# Altium project ProjetManetteCapteurs.PrjPcb
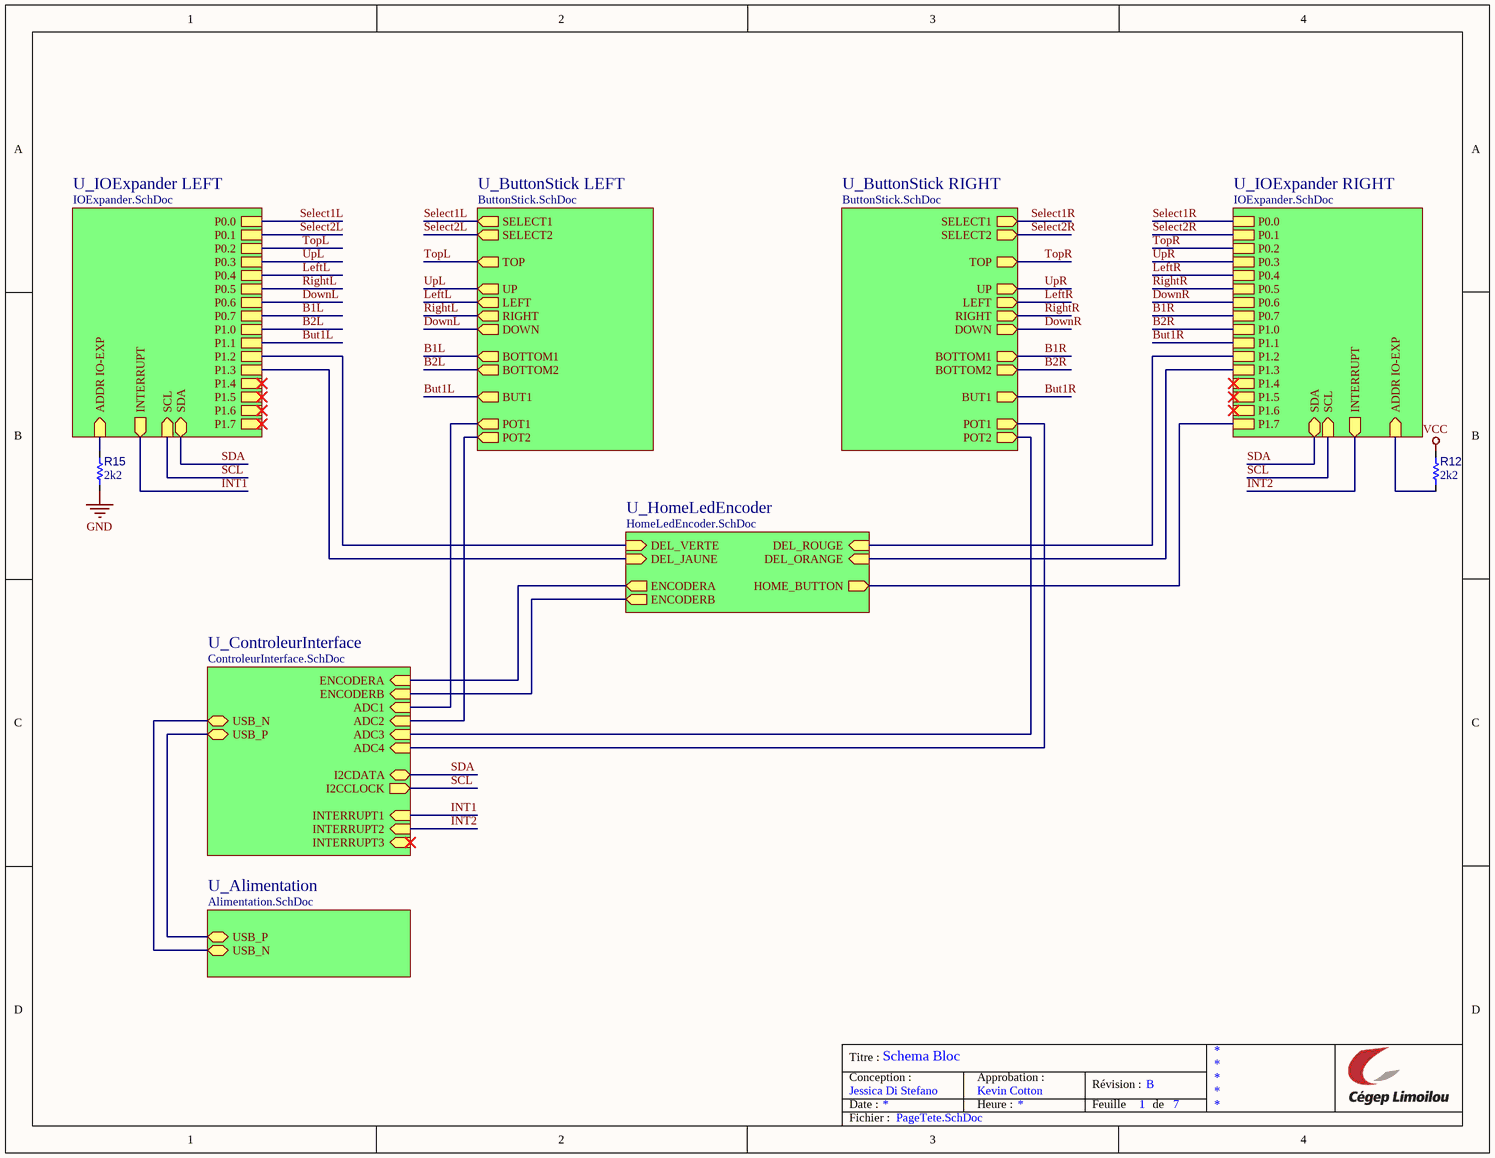
[diagram p0: PageTete.SchDoc]
7 sheets, 73 parts. Net scope: hierarchical (ports join the sheet entries above them; power ports are global).
Board file: CapteurPCB.PcbDoc
Sheets:
  PageTete.SchDoc
    U_Alimentation = Alimentation.SchDoc
    U_ButtonStick LEFT = ButtonStick.SchDoc
    U_ControleurInterface = ControleurInterface.SchDoc
    U_HomeLedEncoder = HomeLedEncoder.SchDoc
    U_IOExpander LEFT = IOExpander.SchDoc
    U_ButtonStick RIGHT = ButtonStick.SchDoc
    U_IOExpander RIGHT = IOExpander.SchDoc
  SchemaBloc.SchDoc

## Sheet PageTete.SchDoc: Schema Bloc
size Letter; ApprovedBy: Kevin Cotton; Author: Jessica Di Stefano; Revision: B; SheetNumber: 1; SheetTotal: 7

### Parts
R12  value 2k2  [R_1005[0402]]  (hidden comment: Res 2k2 1% 0402)
R15  value 2k2  [R_1005[0402]]  (hidden comment: Res 2k2 1% 0402)

### Sub-sheets
U_Alimentation = Alimentation.SchDoc: USB_P (bidir), USB_N (bidir)
U_ButtonStick LEFT = ButtonStick.SchDoc: BOTTOM1 (out), UP (out), LEFT (out), SELECT1 (out), TOP (out), BOTTOM2 (out), RIGHT (out), DOWN (out), SELECT2 (out), POT2 (out), POT1 (out), BUT1 (out)
U_ButtonStick RIGHT = ButtonStick.SchDoc: BOTTOM1 (out), UP (out), LEFT (out), SELECT1 (out), TOP (out), BOTTOM2 (out), RIGHT (out), DOWN (out), SELECT2 (out), POT2 (out), POT1 (out), BUT1 (out)
U_ControleurInterface = ControleurInterface.SchDoc: USB_N (bidir), USB_P (bidir), ADC1 (in), ADC2 (in), ADC3 (in), ADC4 (in), INTERRUPT1 (in), INTERRUPT2 (in), INTERRUPT3 (in), ENCODERB (in), ENCODERA (in), I2CDATA (bidir), I2CCLOCK (out)
U_HomeLedEncoder = HomeLedEncoder.SchDoc: DEL_VERTE (in), DEL_ORANGE (in), DEL_JAUNE (in), DEL_ROUGE (in), ENCODERA (out), ENCODERB (out), HOME_BUTTON (out)
U_IOExpander LEFT = IOExpander.SchDoc: P0.0, P0.1, P0.2, P0.3, P0.4, P0.5, P0.6, P0.7, P1.0, P1.1, P1.2, P1.3, P1.4, P1.5, P1.6, P1.7, ADDR IO-EXP (in), SCL (in), SDA (bidir), INTERRUPT (out)
U_IOExpander RIGHT = IOExpander.SchDoc: P0.0, P0.1, P0.2, P0.3, P0.4, P0.5, P0.6, P0.7, P1.0, P1.1, P1.2, P1.3, P1.4, P1.5, P1.6, P1.7, ADDR IO-EXP (in), SCL (in), SDA (bidir), INTERRUPT (out)

### Nets
GND: R15.1
VCC: R12.2
ADC1: sheet U_ButtonStick LEFT/POT1, sheet U_ControleurInterface/ADC1
ADC2: sheet U_ButtonStick LEFT/POT2, sheet U_ControleurInterface/ADC2
ADC3: sheet U_ControleurInterface/ADC3, sheet U_ButtonStick RIGHT/POT2
ADC4: sheet U_ControleurInterface/ADC4, sheet U_ButtonStick RIGHT/POT1
B1L: sheet U_ButtonStick LEFT/BOTTOM1, sheet U_IOExpander LEFT/P0.7
B1R: sheet U_ButtonStick RIGHT/BOTTOM1, sheet U_IOExpander RIGHT/P0.7
B2L: sheet U_ButtonStick LEFT/BOTTOM2, sheet U_IOExpander LEFT/P1.0
B2R: sheet U_ButtonStick RIGHT/BOTTOM2, sheet U_IOExpander RIGHT/P1.0
But1L: sheet U_ButtonStick LEFT/BUT1, sheet U_IOExpander LEFT/P1.1
But1R: sheet U_ButtonStick RIGHT/BUT1, sheet U_IOExpander RIGHT/P1.1
DownL: sheet U_ButtonStick LEFT/DOWN, sheet U_IOExpander LEFT/P0.6
DownR: sheet U_ButtonStick RIGHT/DOWN, sheet U_IOExpander RIGHT/P0.6
ENCODERA: sheet U_ControleurInterface/ENCODERA, sheet U_HomeLedEncoder/ENCODERA
ENCODERB: sheet U_ControleurInterface/ENCODERB, sheet U_HomeLedEncoder/ENCODERB
INT1: sheet U_ControleurInterface/INTERRUPT1, sheet U_IOExpander LEFT/INTERRUPT
INT2: sheet U_ControleurInterface/INTERRUPT2, sheet U_IOExpander RIGHT/INTERRUPT
LeftL: sheet U_ButtonStick LEFT/LEFT, sheet U_IOExpander LEFT/P0.4
LeftR: sheet U_ButtonStick RIGHT/LEFT, sheet U_IOExpander RIGHT/P0.4
RightL: sheet U_ButtonStick LEFT/RIGHT, sheet U_IOExpander LEFT/P0.5
RightR: sheet U_ButtonStick RIGHT/RIGHT, sheet U_IOExpander RIGHT/P0.5
SCL: sheet U_ControleurInterface/I2CCLOCK, sheet U_IOExpander LEFT/SCL, sheet U_IOExpander RIGHT/SCL  [project net I2CCLOCK]
SDA: sheet U_ControleurInterface/I2CDATA, sheet U_IOExpander LEFT/SDA, sheet U_IOExpander RIGHT/SDA  [project net I2CDATA]
Select1L: sheet U_ButtonStick LEFT/SELECT1, sheet U_IOExpander LEFT/P0.0
Select1R: sheet U_ButtonStick RIGHT/SELECT1, sheet U_IOExpander RIGHT/P0.0
Select2L: sheet U_ButtonStick LEFT/SELECT2, sheet U_IOExpander LEFT/P0.1
Select2R: sheet U_ButtonStick RIGHT/SELECT2, sheet U_IOExpander RIGHT/P0.1
TopL: sheet U_ButtonStick LEFT/TOP, sheet U_IOExpander LEFT/P0.2
TopR: sheet U_ButtonStick RIGHT/TOP, sheet U_IOExpander RIGHT/P0.2
UpL: sheet U_ButtonStick LEFT/UP, sheet U_IOExpander LEFT/P0.3
UpR: sheet U_ButtonStick RIGHT/UP, sheet U_IOExpander RIGHT/P0.3
USB_N: sheet U_Alimentation/USB_N, sheet U_ControleurInterface/USB_N
USB_P: sheet U_Alimentation/USB_P, sheet U_ControleurInterface/USB_P
NetDS1_2: sheet U_HomeLedEncoder/DEL_VERTE, sheet U_IOExpander LEFT/P1.2
NetDS2_2: sheet U_HomeLedEncoder/DEL_ORANGE, sheet U_IOExpander RIGHT/P1.3
NetDS3_2: sheet U_HomeLedEncoder/DEL_JAUNE, sheet U_IOExpander LEFT/P1.3
NetDS4_2: sheet U_HomeLedEncoder/DEL_ROUGE, sheet U_IOExpander RIGHT/P1.2
NetR12_1: R12.1 ; sheet U_IOExpander RIGHT/ADDR IO-EXP
NetR15_2: R15.2 ; sheet U_IOExpander LEFT/ADDR IO-EXP
NetS10_1: sheet U_HomeLedEncoder/HOME_BUTTON, sheet U_IOExpander RIGHT/P1.7

### Notes on the sheet
- Titre :
- Conception :
- Date :
- Approbation :
- Heure :
- Révision :
- Feuille
- de
- Fichier :

### Library data of the parts
R12 R15 = RES008: Resistor type 1; Manufacturer 1: Yageo; Manufacturer Part Number 1: RC0402FR-072K2L; Puissance: 1/16W; Max Working Voltage: 50V; LibRef: RES008; Tolerance: 1%; Mount: SMT; Supplier 1: LCSC; Supplier Part Number 1: C114762; Supplier 2: Digi-Key; Supplier Part Number 2: 311-2.20KLRCT-ND

## Sheet Alimentation.SchDoc: Circuit d'alimentation
size Letter; ApprovedBy: Kevin Cotton; Author: Jessica Di Stefano; Revision: B; SheetNumber: 6; SheetTotal: 7
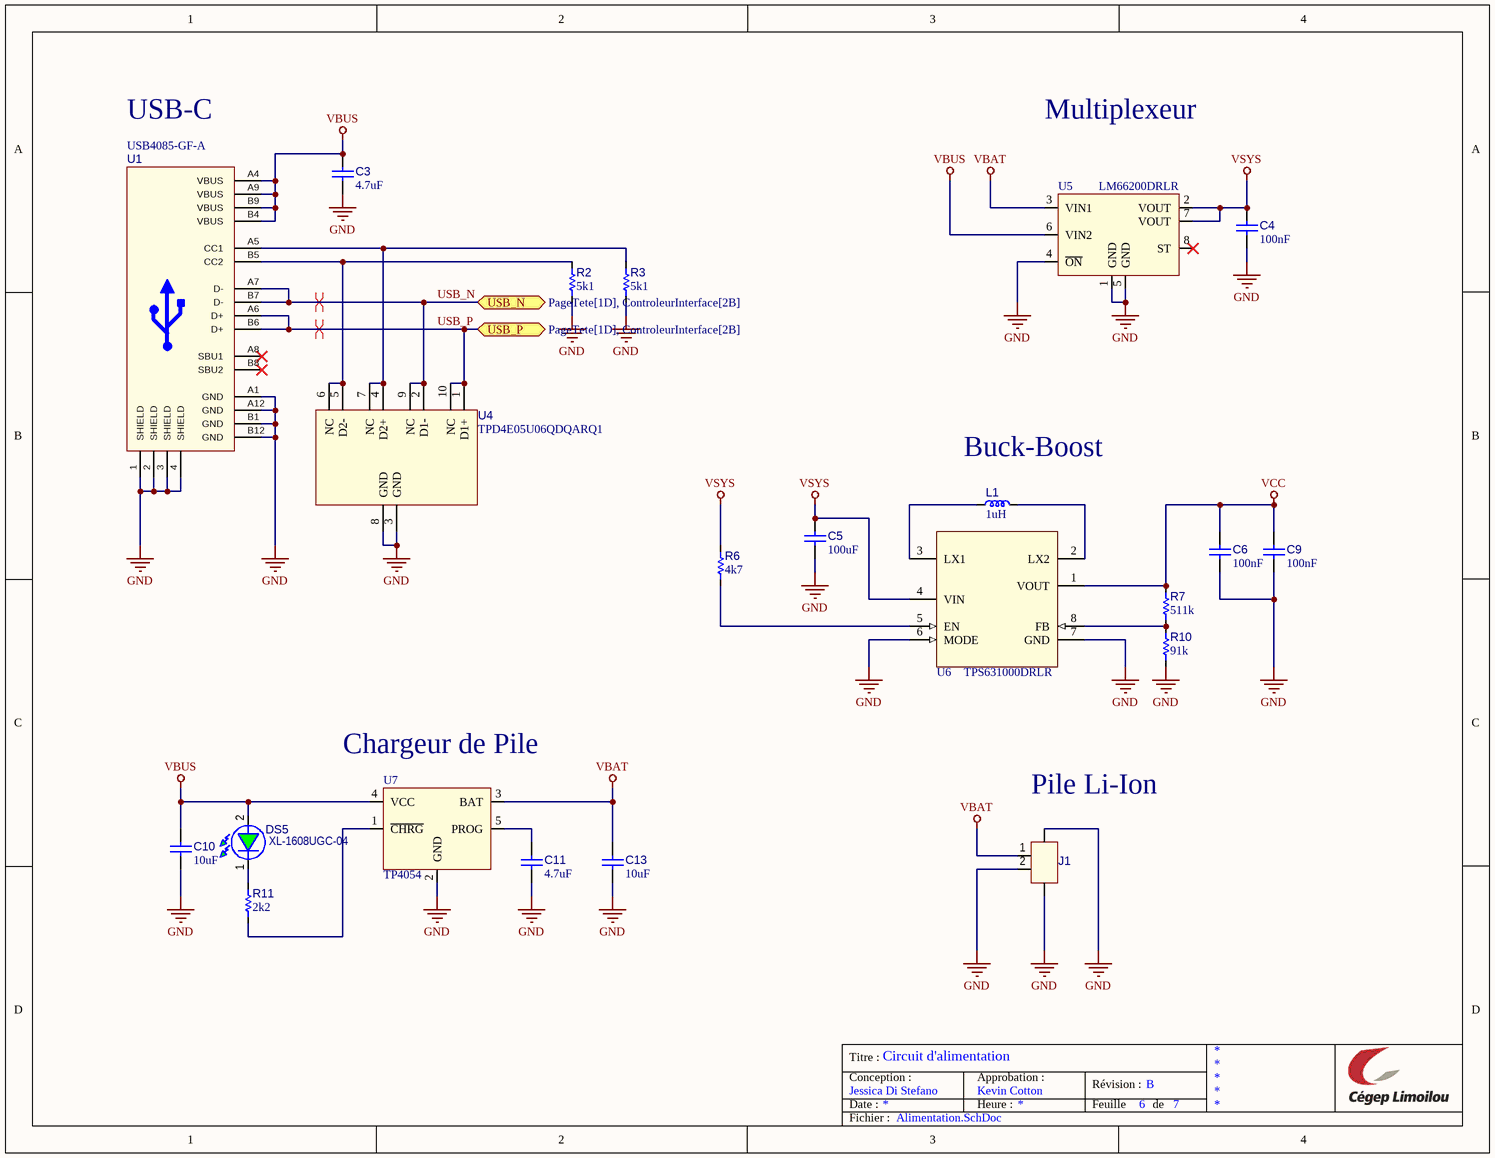
[diagram p1: Alimentation.SchDoc]

### Parts
C3  value 4.7uF  [C_2012[0805]]  (hidden comment: Cap 4.7uF 0805)
C4  value 100nF  [C_1005[0402]]  (hidden comment: Cap 100nF 0402)
C5  value 100uF  [C_3216[1206]]  (hidden comment: Cap 100uF 1206)
C6  value 100nF  [C_1005[0402]]  (hidden comment: Cap 100nF 0402)
C9  value 100nF  [C_1005[0402]]  (hidden comment: Cap 100nF 0402)
C10  value 10uF  [C_2012[0805]]  (hidden comment: Cap 10uF 0805)
C11  value 4.7uF  [C_2012[0805]]  (hidden comment: Cap 4.7uF 0805)
C13  value 10uF  [C_2012[0805]]  (hidden comment: Cap 10uF 0805)
DS5  XL-1608UGC-04  [D_LED_0603]
J1  B2B-PH-SM4-TB  [J_B2B-PH-SM4-TB_JST]  (value not drawn)
L1  value 1uH  [L_3030[1212]]  (hidden comment: Ind 1UH 2.75A 51mOHM SMD)
R2  value 5k1  [R_1005[0402]]  (hidden comment: Res 5k1 1% 0402)
R3  value 5k1  [R_1005[0402]]  (hidden comment: Res 5k1 1% 0402)
R6  value 4k7  [R_1005[0402]]  (hidden comment: Res 4k7 1% 0402)
R7  value 511k  [R_1005[0402]]  (hidden comment: Res 511k 1% 0402)
R10  value 91k  [R_1005[0402]]  (hidden comment: Res 91k 1% 0402)
R11  value 2k2  [R_1005[0402]]  (hidden comment: Res 2k2 1% 0402)
U1  USB4085-GF-A  [FP-USB4085-GF-A-MFG]
U4  TPD4E05U06QDQARQ1  [U_USON50P250X100-10]
U5  LM66200DRLR  [U_SOT583_50P210X120X60-8]
U6  TPS631000DRLR  [U_SOT583_50P210X120X60-8]
U7  TP4054  [U_SOT23-5N(MO-178)]

### Ports
USB_N (bidir, see PageTete[1D], ControleurInterface[2B]), USB_P (bidir, see PageTete[1D], ControleurInterface[2B])

### Nets
GND: C3.1 C4.1 C5.1 C6.2 C9.1 C10.1 C11.1 C13.1 J1.2(Pin_2) J1.S1 J1.S2 R2.1 R3.1 R10.1 U1.1(SHIELD) U1.2(SHIELD) U1.3(SHIELD) U1.4(SHIELD) U1.A1(GND) U1.A12(GND) U1.B1(GND) U1.B12(GND) U4.3(GND) U4.8(GND) U5.1(GND) U5.4(~{ON}) U5.5(GND) U6.6(MODE) U6.7(GND) U7.2(GND)
VBAT: C13.2 J1.1(Pin_1) U5.3(VIN1) U7.3(BAT)
VBUS: C3.2 C10.2 DS5.2(A) U1.A4(VBUS) U1.A9(VBUS) U1.B4(VBUS) U1.B9(VBUS) U5.6(VIN2) U7.4(VCC)
VCC: C6.1 C9.2 R7.2 U6.1(VOUT)
VSYS: C4.2 C5.2 R6.2 U5.2(VOUT) U5.7(VOUT) U6.4(VIN)
USB_N: U1.A7(D-) U1.B7(D-) U4.2(D1-) U4.9(NC) ; port USB_N
USB_P: U1.A6(D+) U1.B6(D+) U4.1(D1+) U4.10(NC) ; port USB_P
NetC11_2: C11.2 U7.5(PROG)
NetDS5_1: DS5.1(K) R11.2
NetL1_1: L1.1 U6.3(LX1)
NetL1_2: L1.2 U6.2(LX2)
NetR2_2: R2.2 U1.B5(CC2) U4.5(D2-) U4.6(NC)
NetR3_2: R3.2 U1.A5(CC1) U4.4(D2+) U4.7(NC)
NetR6_1: R6.1 U6.5(EN)
NetR7_1: R7.1 R10.2 U6.8(FB)
NetR11_1: R11.1 U7.1(~{CHRG})

Not connected (* = marked no-connect by the designer): U1 A8(SBU1)* B8(SBU2)*; U5 8(ST)*

### Layout directives
differential pair: USB_N, USB_P

### Notes on the sheet
- USB-C
- Multiplexeur
- (near L1) Buck-Boost
- (near U7) Chargeur de Pile
- (near J1) Pile Li-Ion
- Titre :
- Conception :
- Date :
- Approbation :
- Heure :
- Révision :
- Feuille
- de
- Fichier :

### Library data of the parts
C3 C11 = CAP003: Capacitor type 1; Manufacturer 1: Taiyo Yuden; Manufacturer Part Number 1: TMK212AB7475KG-T; CEGEP: KCOND02SM; Tolerance: 10%; Rated Voltage: 25V; Dielectric: X7R; LibRef: CAP003; Mount: SMT; Supplier 1: LCSC; Supplier Part Number 1: C163186
C4 C6 C9 = CAP001: Capacitor type 1; Manufacturer 1: Taiyo Yuden; Manufacturer Part Number 1: UMK105B7104KV-FR; CEGEP: KCOND01SM; Tolerance: 10%; Rated Voltage: 50V; Dielectric: X7R; LibRef: CAP001; Mount: SMT; Supplier 1: LCSC; Supplier Part Number 1: C2167491
C5 = CAP005: Capacitor type 1; Manufacturer 1: Murata; Manufacturer Part Number 1: GRM31CR61A107MEA8L; CEGEP: KCOND04SM; Tolerance: 20%; Rated Voltage: 10V; Dielectric: X5R; LibRef: CAP005; Mount: SMT; Supplier 1: LCSC; Supplier Part Number 1: C883598
C10 C13 = CAP004: Capacitor type 1; Manufacturer 1: Samsung; Manufacturer Part Number 1: CL21A106KAYNNNE; CEGEP: KCOND03SM; Tolerance: 10%; Rated Voltage: 25V; Dielectric: X5R; LibRef: CAP004; Mount: SMT; Supplier 1: LCSC; Supplier Part Number 1: C15850
DS5 = D_LED_GREEN_0603: LED Green Clear 40mcd 140deg; Manufacturer 1: XINGLIGHT; CEGEP: KLEDVC0603; Value: Green; Manufacturer 2: Wurth; Manufacturer Part Number 1: XL-1608UGC-04; Manufacturer Part Number 2: 150060VS75000; Mounting Technology: SMT; Supplier 1: LCSC; Supplier 2: Digikey; Supplier Part Number 1: C965804; Supplier Part Number 2: 732-4980-1-ND
J1 = Conn_01x02_B2B-PH-SM4-TB: Conn. 2 pins JST B2B SMT Straight 2mm; Value: Conn_01x02 SMT; CEGEP: KPTSO08; Manufacturer 1: JST; Manufacturer Part Number 1: B2B-PH-SM4-TB; Mounting Technology: SMT; Supplier 1: LCSC; Supplier 2: Mouser; Supplier Part Number 1: C160352; Supplier Part Number 2: 306-B2BPHSM4TBLFSN
L1 = IND001: Inductor type 1; Manufacturer 1: Murata Electronics; Manufacturer Part Number 1: LQH3NPN1R0MMEL; CEGEP: KPTSO09; Tolerance: 0,2; DCR: 0.025R; Saturation Current: 2.3A; LibRef: IND001; Mount: SMT; Supplier 1: LCSC; Supplier Part Number 1: C703777
R2 R3 = RES010: Resistor type 1; Manufacturer 1: Panasonic; Manufacturer Part Number 1: ERJ-2RKF5101X; Puissance: 1/16W; Max Working Voltage: 50V; LibRef: RES010; Tolerance: 1%; Mount: SMT; Supplier 1: LCSC; Supplier Part Number 1: C25905
R6 = RES007: Resistor type 1; Manufacturer 1: Panasonic; Manufacturer Part Number 1: ERJ-2RKF4701X; Puissance: 1/16W; Max Working Voltage: 50V; LibRef: RES007; Tolerance: 1%; Mount: SMT; Supplier 1: LCSC; Supplier Part Number 1: C400631
R7 = RES012: Resistor type 1; Manufacturer 1: Panasonic; Manufacturer Part Number 1: ERJ-2RKF5113X; Puissance: 1/16W; Max Working Voltage: 50V; LibRef: RES012; Tolerance: 1%; Mounting Technology: SMT; Supplier 1: LCSC; Supplier Part Number 1: C441727
R10 = RES011: Resistor type 1; Manufacturer 1: Panasonic; Manufacturer Part Number 1: ERJ-2RKF9102X; Puissance: 1/16W; Max Working Voltage: 50V; LibRef: RES011; Tolerance: 1%; Mount: SMT; Supplier 1: LCSC; Supplier Part Number 1: C413106
R11 = RES008: as R12 on sheet PageTete; LibRef: RES008; Tolerance: 1%; Mount: SMT; Supplier 1: LCSC; Supplier Part Number 1: C114762; Supplier 2: Digi-Key; Supplier Part Number 2: 311-2.20KLRCT-ND
U1 = Conn_USB-C_16pos: CONN RCPT USB2.0 TYPE C RA - TH; Manufacturer 1: Global Connector Technology; Manufacturer Part Number 1: USB4085-GF-A; Mounting Technology: TH; Supplier 1: LCSC; Supplier 2: Digikey; Supplier Part Number 1: C7095263; Supplier Part Number 2: 2073-USB4085-GF-ACT-ND
U4 = U_TPD4E05U06: TVS DIODE 5.5V 14V 10USON; Manufacturer 1: Texas Instruments; Manufacturer 2: ElecSuper; Manufacturer Part Number 2: TPD4E05U06QDQARQ1-ES; Manufacturer Part Number 1: TPD4E05U06QDQARQ1; Mounting Technology: SMT; Supplier 1: LCSC; Supplier 2: Digikey; Supplier Part Number 1: C81353; Supplier Part Number 2: 296-40696-1-ND
U5 = U_LM66200DRLR: ORing Controller N-Channel 2:1 SOT-583; Manufacturer 1: Texas Instruments; CEGEP: KPTSO05; Manufacturer Part Number 1: LM66200DRLR; Supplier 1: LCSC; Supplier 2: Digikey; Supplier Part Number 1: C3235556; Supplier Part Number 2: 296-LM66200DRLRCT-ND; Mounting Technology: SMT
U6 = U_TPS631000DRLR: buck-boost converter 1.5-A output current,; Manufacturer 1: Texas Instruments; CEGEP: KPTSO09; Manufacturer Part Number 1: TPS631000DRLR; Supplier 1: LCSC; Supplier 2: Digikey; Supplier Part Number 1: C5219190; Supplier Part Number 2: 296-TPS631000DRLRCT-ND; Mounting Technology: SMT
U7 = U_TP4054: Battery charger Li-ion Linear 1-cell; Manufacturer 1: HXY MOSFET; CEGEP: KPTSO06; Manufacturer 2: Suntek; Manufacturer Part Number 2: SK4054S5-42; Manufacturer Part Number 1: TP4054; Supplier 1: LCSC; Supplier 2: Digikey; Supplier Part Number 1: C668215; Supplier Part Number 2: 4518-TP4054CT-ND; Mounting Technology: SMT

## Sheet ButtonStick.SchDoc: Button Stick
size Letter; ApprovedBy: Kevin Cotton; Author: Jessica Di Stefano; DrawnBy: J; Revision: A; SheetNumber: 3; SheetTotal: 7
Used 2 times, as channels U_ButtonStick LEFT, U_ButtonStick RIGHT. Parts and nets are listed once, with the designators drawn on the sheet.
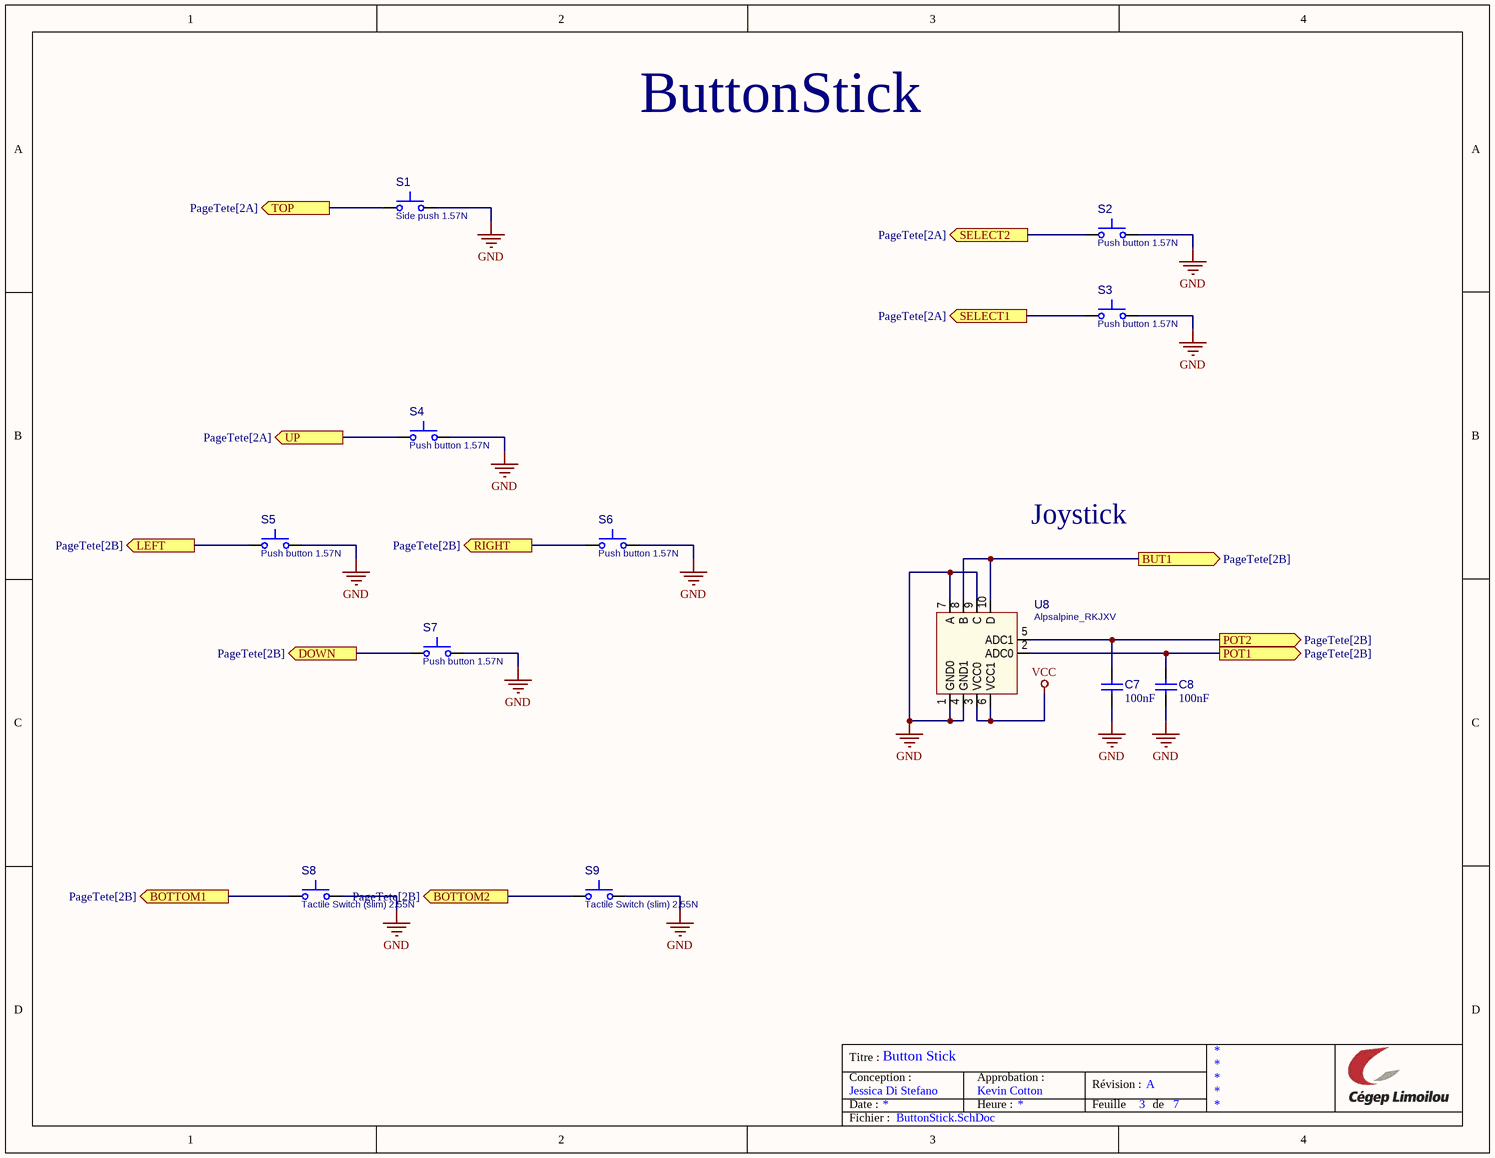
[diagram p2: ButtonStick.SchDoc]

### Parts
C7  value 100nF  [C_1005[0402]]  (hidden comment: Cap 100nF 0402)
C8  value 100nF  [C_1005[0402]]  (hidden comment: Cap 100nF 0402)
S1  value Side push 1.57N  [S_Alpsalpine_SKHHL]  (hidden comment: SKHHLNA010)
S2  value Push button 1.57N  [S_Alpsalpine_SKPM]  (hidden comment: SKPMAME010)
S3  value Push button 1.57N  [S_Alpsalpine_SKPM]  (hidden comment: SKPMAME010)
S4  value Push button 1.57N  [S_Alpsalpine_SKPM]  (hidden comment: SKPMAME010)
S5  value Push button 1.57N  [S_Alpsalpine_SKPM]  (hidden comment: SKPMAME010)
S6  value Push button 1.57N  [S_Alpsalpine_SKPM]  (hidden comment: SKPMAME010)
S7  value Push button 1.57N  [S_Alpsalpine_SKPM]  (hidden comment: SKPMAME010)
S8  value Tactile Switch (slim) 2.55N  [S_Alpsalpine_SKQG]  (hidden comment: SKQGADE010)
S9  value Tactile Switch (slim) 2.55N  [S_Alpsalpine_SKQG]  (hidden comment: SKQGADE010)
U8  value Alpsalpine_RKJXV  [U_Alpsalpine_RKJXV122400R]  (hidden comment: RKJXV122400R)

### Ports
BOTTOM1 (out, see PageTete[2B]), BOTTOM2 (out, see PageTete[2B]), BUT1 (out, see PageTete[2B]), DOWN (out, see PageTete[2B]), LEFT (out, see PageTete[2B]), POT1 (out, see PageTete[2B]), POT2 (out, see PageTete[2B]), RIGHT (out, see PageTete[2B]), SELECT1 (out, see PageTete[2A]), SELECT2 (out, see PageTete[2A]), TOP (out, see PageTete[2A]), UP (out, see PageTete[2A])

### Nets
GND: C7.1 C8.1 S1.2 S2.2 S3.2 S4.2 S5.2 S6.2 S7.2 S8.2 S9.2 U8.1(GND0) U8.4(GND1) U8.7(A) U8.9(C)
VCC: U8.3(VCC0) U8.6(VCC1)
BOTTOM1: S8.1 ; port BOTTOM1
BOTTOM2: S9.1 ; port BOTTOM2
BUT1: U8.8(B) U8.10(D) ; port BUT1
DOWN: S7.1 ; port DOWN
LEFT: S5.1 ; port LEFT
POT1: C8.2 U8.2(ADC0) ; port POT1
POT2: C7.2 U8.5(ADC1) ; port POT2
RIGHT: S6.1 ; port RIGHT
SELECT1: S3.1 ; port SELECT1
SELECT2: S2.1 ; port SELECT2
TOP: S1.1 ; port TOP
UP: S4.1 ; port UP

### Channels
U_ButtonStick LEFT: designators end in A; ports BOTTOM1=B1L BOTTOM2=B2L BUT1=But1L DOWN=DownL LEFT=LeftL POT1=ADC1 POT2=ADC2 RIGHT=RightL SELECT1=Select1L SELECT2=Select2L TOP=TopL UP=UpL
U_ButtonStick RIGHT: designators end in B; ports BOTTOM1=B1R BOTTOM2=B2R BUT1=But1R DOWN=DownR LEFT=LeftR POT1=ADC4 POT2=ADC3 RIGHT=RightR SELECT1=Select1R SELECT2=Select2R TOP=TopR UP=UpR

### Notes on the sheet
- ButtonStick
- Joystick
- Titre :
- Conception :
- Date :
- Approbation :
- Heure :
- Révision :
- Feuille
- de
- Fichier :

### Library data of the parts
C7 C8 = CAP001: as C4 on sheet Alimentation; LibRef: CAP001; Mount: SMT; Supplier 1: LCSC; Supplier Part Number 1: C2167491
S1 = SW_Push_SKHHL_157N: Side push 6.0mm Square Type (Snap-in) 1.57N l=3.85mm; Manufacturer 1: ALPSALPINE; Manufacturer Part Number 1: SKHHLNA010; Mounting Technology: TH; Supplier 1: LCSC; Supplier 2: DigiKey; Supplier Part Number 1: C125031; Supplier Part Number 2: 4809-SKHHLNA010-ND
S2-S7 = SW_Push_SKPM_157N: Push button 1.57N; Manufacturer 1: ALPSALPINE; Manufacturer Part Number 1: SKPMAME010; Mounting Technology: SMT; Supplier 1: LCSC; Supplier 2: DigiKey; Supplier Part Number 1: C115348; Supplier Part Number 2: 4809-SKPMAME010CT-ND
S8 S9 = SW_Push_SKQG_255N: Tactile Switch (dome) 2.55N; Manufacturer 1: ALPSALPINE; Manufacturer Part Number 1: SKQGADE010; Mounting Technology: SMT; Supplier 1: LCSC; Supplier 2: Digikey; Supplier Part Number 1: C116647; Supplier Part Number 2: 4809-SKQGADE010CT-ND
U8 = U_Alpsalpine_RKJXV: ThumbStick; Manufacturer 1: ALPSALPINE; Manufacturer Part Number 1: RKJXV122400R; Mounting Technology: TH; Supplier 1: LCSC; Supplier 2: Mouser; Supplier Part Number 1: C918854; Supplier Part Number 2: 688-RKJXV122400R

## Sheet ControleurInterface.SchDoc: Connecteur B2B
size Letter; ApprovedBy: Kevin Cotton; Author: Jessica Di Stefano; Revision: A; SheetNumber: 5; SheetTotal: 7
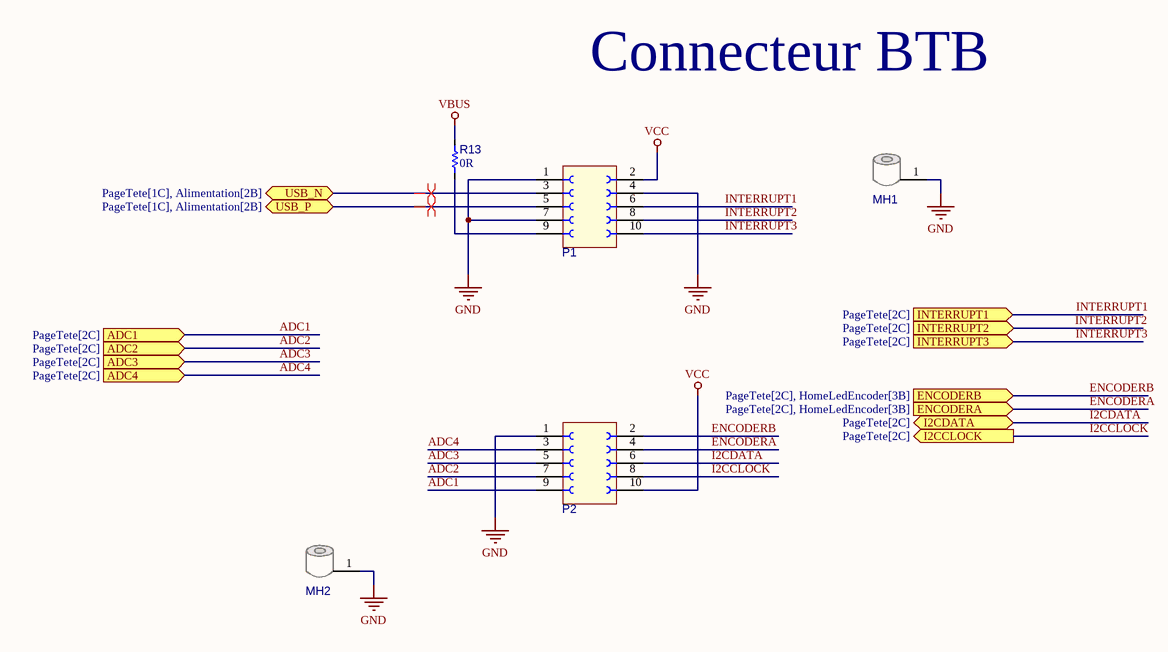
[diagram p3: ControleurInterface.SchDoc]

### Parts
MH1  SMTSO1430MTJ  [MP_Standoff_M1.4x3mm_SMT]  (value not drawn)
MH2  SMTSO1430MTJ  [MP_Standoff_M1.4x3mm_SMT]  (value not drawn)
P1  HC-PBB12NB(3.0)-10DP-0.5V-03  [P_CONN_HDR_2ROW_10POS_0MM5]  (value not drawn)
P2  HC-PBB12NB(3.0)-10DP-0.5V-03  [P_CONN_HDR_2ROW_10POS_0MM5]  (value not drawn)
R13  value 0R  [R_1005[0402]]  (hidden comment: Res 0R 0402)

### Ports
ADC1 (in, see PageTete[2C]), ADC2 (in, see PageTete[2C]), ADC3 (in, see PageTete[2C]), ADC4 (in, see PageTete[2C]), ENCODERA (in, see PageTete[2C], HomeLedEncoder[3B]), ENCODERB (in, see PageTete[2C], HomeLedEncoder[3B]), I2CCLOCK (out, see PageTete[2C]), I2CDATA (bidir, see PageTete[2C]), INTERRUPT1 (in, see PageTete[2C]), INTERRUPT2 (in, see PageTete[2C]), INTERRUPT3 (in, see PageTete[2C]), USB_N (bidir, see PageTete[1C], Alimentation[2B]), USB_P (bidir, see PageTete[1C], Alimentation[2B])

### Nets
GND: MH1.1 MH2.1 P1.1 P1.4 P1.7 P2.1
VBUS: R13.2
VCC: P1.2 P2.10
ADC1: P2.9 ; port ADC1
ADC2: P2.7 ; port ADC2
ADC3: P2.5 ; port ADC3
ADC4: P2.3 ; port ADC4
ENCODERA: P2.4 ; port ENCODERA
ENCODERB: P2.2 ; port ENCODERB
I2CCLOCK: P2.8 ; port I2CCLOCK
I2CDATA: P2.6 ; port I2CDATA
INTERRUPT1: P1.6 ; port INTERRUPT1  [project net INT1]
INTERRUPT2: P1.8 ; port INTERRUPT2  [project net INT2]
INTERRUPT3: P1.10 ; port INTERRUPT3
USB_N: P1.3 ; port USB_N
USB_P: P1.5 ; port USB_P
NetP1_9: P1.9 R13.1

### Layout directives
differential pair: USB_N, USB_P

### Notes on the sheet
- Connecteur BTB
- Titre :
- Conception :
- Date :
- Approbation :
- Heure :
- Révision :
- Feuille
- de
- Fichier :

### Library data of the parts
MH1 MH2 = MP_1.4MM_3MM_SMD: Mounting Standoff Threaded 1.4mm, stack height 3mm, SMD; Manufacturer 1: Sinhoo; Manufacturer Part Number 1: SMTSO1430MTJ; Mounting Technology: SMT; Supplier 1: LCSC; Supplier Part Number 1: C2915624
P1 P2 = Conn_02x05_Header: Connector Header 2x5pos, 0,5mm; Manufacturer 1: HCTL; Manufacturer 2: Hirose; Manufacturer Part Number 1: HC-PBB12NB(3.0)-10DP-0.5V-03; Manufacturer Part Number 2: DF12NB(3.0)-10DP-0.5V(51); Mounting Technology: SMT; Value: Conn_02x05; Supplier 1: LCSC; Supplier 2: Digikey; Supplier Part Number 1: C22359413; Supplier Part Number 2: 26-DF12NB(3.0)-10DP-0.5V(51)CT-ND
R13 = RES005: Resistor type 1; Manufacturer 1: Yageo; Manufacturer Part Number 1: RC0402JR-070RL; Max Working Voltage: 50V; LibRef: RES005; Mounting Technology: SMT; Supplier 1: LCSC; Supplier Part Number 1: C60485

## Sheet HomeLedEncoder.SchDoc: HomeLedEncoder
size Letter; ApprovedBy: Kevin Cotton; Author: Jessica Di Stefano; Revision: A; SheetNumber: 2; SheetTotal: 7
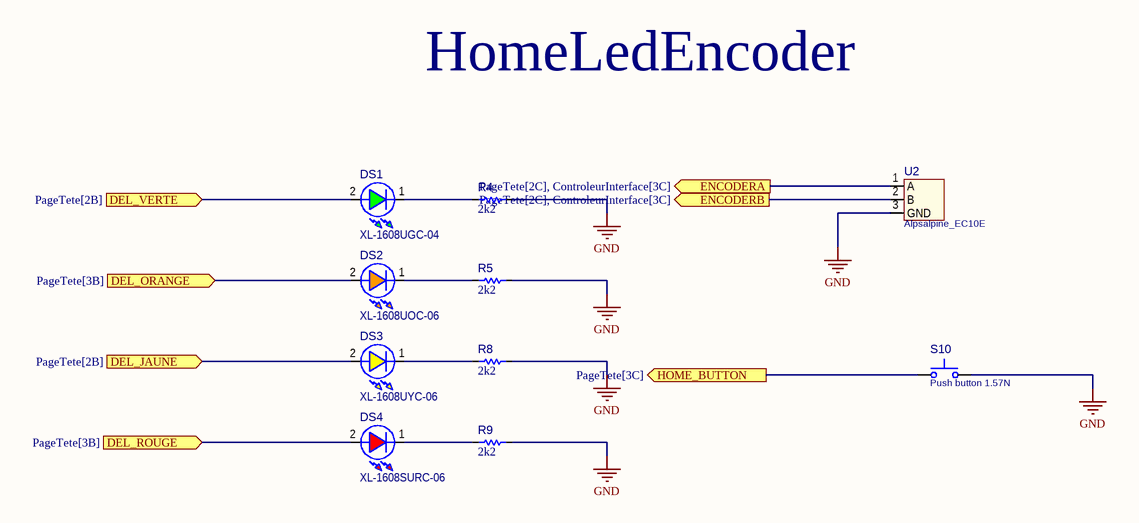
[diagram p4: HomeLedEncoder.SchDoc]

### Parts
DS1  XL-1608UGC-04  [D_LED_0603]
DS2  XL-1608UOC-06  [D_LED_0603]
DS3  XL-1608UYC-06  [D_LED_0603]
DS4  XL-1608SURC-06  [D_LED_0603]
R4  value 2k2  [R_1005[0402]]  (hidden comment: Res 2k2 1% 0402)
R5  value 2k2  [R_1005[0402]]  (hidden comment: Res 2k2 1% 0402)
R8  value 2k2  [R_1005[0402]]  (hidden comment: Res 2k2 1% 0402)
R9  value 2k2  [R_1005[0402]]  (hidden comment: Res 2k2 1% 0402)
S10  value Push button 1.57N  [S_Alpsalpine_SKPM]  (hidden comment: SKPMAME010)
U2  value Alpsalpine_EC10E  [U_Alpsalpine_EC10E]  (hidden comment: EC10E1220503)

### Ports
DEL_JAUNE (in, see PageTete[2B]), DEL_ORANGE (in, see PageTete[3B]), DEL_ROUGE (in, see PageTete[3B]), DEL_VERTE (in, see PageTete[2B]), ENCODERA (out, see PageTete[2C], ControleurInterface[3C]), ENCODERB (out, see PageTete[2C], ControleurInterface[3C]), HOME_BUTTON (out, see PageTete[3C])

### Nets
GND: R4.2 R5.2 R8.2 R9.2 S10.2 U2.3(GND)
ENCODERA: U2.1(A) ; port ENCODERA
ENCODERB: U2.2(B) ; port ENCODERB
NetDS1_1: DS1.1(K) R4.1
NetDS1_2: DS1.2(A) ; port DEL_VERTE
NetDS2_1: DS2.1(K) R5.1
NetDS2_2: DS2.2(A) ; port DEL_ORANGE
NetDS3_1: DS3.1(K) R8.1
NetDS3_2: DS3.2(A) ; port DEL_JAUNE
NetDS4_1: DS4.1(K) R9.1
NetDS4_2: DS4.2(A) ; port DEL_ROUGE
NetS10_1: S10.1 ; port HOME_BUTTON

### Notes on the sheet
- HomeLedEncoder
- Titre :
- Conception :
- Date :
- Approbation :
- Heure :
- Révision :
- Feuille
- de
- Fichier :

### Library data of the parts
DS1 = D_LED_GREEN_0603: as DS5 on sheet Alimentation; Value: Green; Manufacturer 2: Wurth; Manufacturer Part Number 1: XL-1608UGC-04; Manufacturer Part Number 2: 150060VS75000; Mounting Technology: SMT; Supplier 1: LCSC; Supplier 2: Digikey; Supplier Part Number 1: C965804; Supplier Part Number 2: 732-4980-1-ND
DS2 = D_LED_ORANGE_0603: LED Orange Clear; Manufacturer 1: XINGLIGHT; CEGEP: KLEDOC0603; Value: Orange; Manufacturer 2: Wurth; Manufacturer Part Number 1: XL-1608UOC-06; Manufacturer Part Number 2: 150060AS75000; Mounting Technology: SMT; Supplier 1: LCSC; Supplier 2: Digikey; Supplier Part Number 1: C965800; Supplier Part Number 2: 732-150060AS75000CT-ND
DS3 = D_LED_YELLOW_0603: LED Yellow Clear; Manufacturer 1: XINGLIGHT; CEGEP: KLEDJC0603; Value: Yellow; Manufacturer 2: Wurth; Manufacturer Part Number 1: XL-1608UYC-06; Manufacturer Part Number 2: 150060YS75000; Mounting Technology: SMT; Supplier 1: LCSC; Supplier 2: Digikey; Supplier Part Number 1: C965802; Supplier Part Number 2: 732-4981-1-ND
DS4 = D_LED_RED_0603: LED Red Clear 60mcd 140deg; Manufacturer 1: XINGLIGHT; CEGEP: KLEDRC0603; Value: Red; Manufacturer 2: Wurth; Manufacturer Part Number 1: XL-1608SURC-06; Manufacturer Part Number 2: 150060SS75000; Mounting Technology: SMT; Supplier 1: LCSC; Supplier 2: Digikey; Supplier Part Number 1: C965799; Supplier Part Number 2: 732-4979-1-ND
R4 R5 R8 R9 = RES008: as R12 on sheet PageTete; LibRef: RES008; Tolerance: 1%; Mount: SMT; Supplier 1: LCSC; Supplier Part Number 1: C114762; Supplier 2: Digi-Key; Supplier Part Number 2: 311-2.20KLRCT-ND
S10 = SW_Push_SKPM_157N: as S2 on sheet ButtonStick; Manufacturer Part Number 1: SKPMAME010; Mounting Technology: SMT; Supplier 1: LCSC; Supplier 2: DigiKey; Supplier Part Number 1: C115348; Supplier Part Number 2: 4809-SKPMAME010CT-ND
U2 = U_Alpsalpine_EC10E: Rotary Encoder TH; Manufacturer 1: ALPSALPINE; Manufacturer Part Number 1: EC10E1220503; Mounting Technology: TH; Supplier 1: LCSC; Supplier 2: DigiKey; Supplier Part Number 1: C110291; Supplier Part Number 2: 4809-EC10E1220503-ND

## Sheet IOExpander.SchDoc: I/O Expander
size Letter; ApprovedBy: Kevin Cotton; Author: Jessica Di Stefano; DrawnBy: Jessica Di Stefano; Revision: A; SheetNumber: 4; SheetTotal: 7
Used 2 times, as channels U_IOExpander LEFT, U_IOExpander RIGHT. Parts and nets are listed once, with the designators drawn on the sheet.
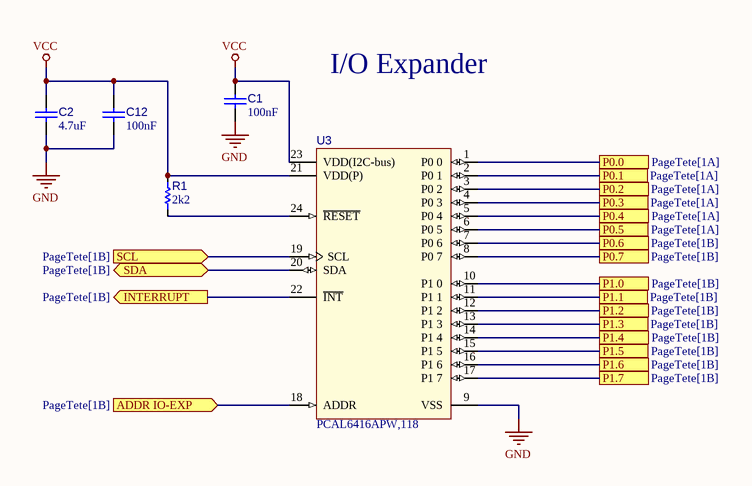
[diagram p5: IOExpander.SchDoc]

### Parts
C1  value 100nF  [C_1005[0402]]  (hidden comment: Cap 100nF 0402)
C2  value 4.7uF  [C_2012[0805]]  (hidden comment: Cap 4.7uF 0805)
C12  value 100nF  [C_1005[0402]]  (hidden comment: Cap 100nF 0402)
R1  value 2k2  [R_1005[0402]]  (hidden comment: Res 2k2 1% 0402)
U3  PCAL6416APW,118  [U_TSSOP24_SOT355-1-IPC_B]

### Ports
ADDR IO-EXP (in, see PageTete[1B]), INTERRUPT (out, see PageTete[1B]), P0.0 (see PageTete[1A]), P0.1 (see PageTete[1A]), P0.2 (see PageTete[1A]), P0.3 (see PageTete[1A]), P0.4 (see PageTete[1A]), P0.5 (see PageTete[1A]), P0.6 (see PageTete[1B]), P0.7 (see PageTete[1B]), P1.0 (see PageTete[1B]), P1.1 (see PageTete[1B]), P1.2 (see PageTete[1B]), P1.3 (see PageTete[1B]), P1.4 (see PageTete[1B]), P1.5 (see PageTete[1B]), P1.6 (see PageTete[1B]), P1.7 (see PageTete[1B]), SCL (in, see PageTete[1B]), SDA (bidir, see PageTete[1B])

### Nets
GND: C1.1 C2.1 C12.1 U3.9(VSS)
VCC: C1.2 C2.2 C12.2 R1.2 U3.21(VDD(P)) U3.23(VDD(I2C-bus))
ADDR IO-EXP: U3.18(ADDR) ; port ADDR IO-EXP
INTERRUPT: U3.22(~{INT}) ; port INTERRUPT
P0.0: U3.1(P0_0) ; port P0.0
P0.1: U3.2(P0_1) ; port P0.1
P0.2: U3.3(P0_2) ; port P0.2
P0.3: U3.4(P0_3) ; port P0.3
P0.4: U3.5(P0_4) ; port P0.4
P0.5: U3.6(P0_5) ; port P0.5
P0.6: U3.7(P0_6) ; port P0.6
P0.7: U3.8(P0_7) ; port P0.7
P1.0: U3.10(P1_0) ; port P1.0
P1.1: U3.11(P1_1) ; port P1.1
P1.2: U3.12(P1_2) ; port P1.2
P1.3: U3.13(P1_3) ; port P1.3
P1.4: U3.14(P1_4) ; port P1.4
P1.5: U3.15(P1_5) ; port P1.5
P1.6: U3.16(P1_6) ; port P1.6
P1.7: U3.17(P1_7) ; port P1.7
SCL: U3.19(SCL) ; port SCL
SDA: U3.20(SDA) ; port SDA
NetR1_1: R1.1 U3.24(~{RESET})

### Channels
U_IOExpander LEFT: designators end in A; ports ADDR IO-EXP=NetR15_2 INTERRUPT=INT1 P0.0=Select1L P0.1=Select2L P0.2=TopL P0.3=UpL P0.4=LeftL P0.5=RightL P0.6=DownL P0.7=B1L P1.0=B2L P1.1=But1L P1.2=NetDS1_2 P1.3=NetDS3_2 P1.4=NetU3A_14 P1.5=NetU3A_15 P1.6=NetU3A_16 P1.7=NetU3A_17 SCL=I2CCLOCK SDA=I2CDATA
U_IOExpander RIGHT: designators end in B; ports ADDR IO-EXP=NetR12_1 INTERRUPT=INT2 P0.0=Select1R P0.1=Select2R P0.2=TopR P0.3=UpR P0.4=LeftR P0.5=RightR P0.6=DownR P0.7=B1R P1.0=B2R P1.1=But1R P1.2=NetDS4_2 P1.3=NetDS2_2 P1.4=NetU3B_14 P1.5=NetU3B_15 P1.6=NetU3B_16 P1.7=NetS10_1 SCL=I2CCLOCK SDA=I2CDATA

### Notes on the sheet
- I/O Expander
- Titre :
- Conception :
- Date :
- Approbation :
- Heure :
- Révision :
- Feuille
- de
- Fichier :

### Library data of the parts
C1 C12 = CAP001: as C4 on sheet Alimentation; LibRef: CAP001; Mount: SMT; Supplier 1: LCSC; Supplier Part Number 1: C2167491
C2 = CAP003: as C3 on sheet Alimentation; LibRef: CAP003; Mount: SMT; Supplier 1: LCSC; Supplier Part Number 1: C163186
R1 = RES008: as R12 on sheet PageTete; LibRef: RES008; Tolerance: 1%; Mount: SMT; Supplier 1: LCSC; Supplier Part Number 1: C114762; Supplier 2: Digi-Key; Supplier Part Number 2: 311-2.20KLRCT-ND
U3 = U_PCAL6416APW: IC I/O EXPANDER 16BIT 24TSSOP; Manufacturer Part Number 1: TCAL6416PWR; Manufacturer 1: Texas Instruments; Manufacturer 2: NXP Semiconductors; Manufacturer Part Number 2: PCAL6416APW,118; Mounting Technology: SMT; Supplier 1: LCSC; Supplier 2: LCSC; Supplier 3: Digikey; Supplier Part Number 1: C20345827; Supplier Part Number 2: C2652299; Supplier Part Number 3: 568-9922-1-ND

## Sheet SchemaBloc.SchDoc
size Letter; SheetNumber: 1; SheetTotal: 2
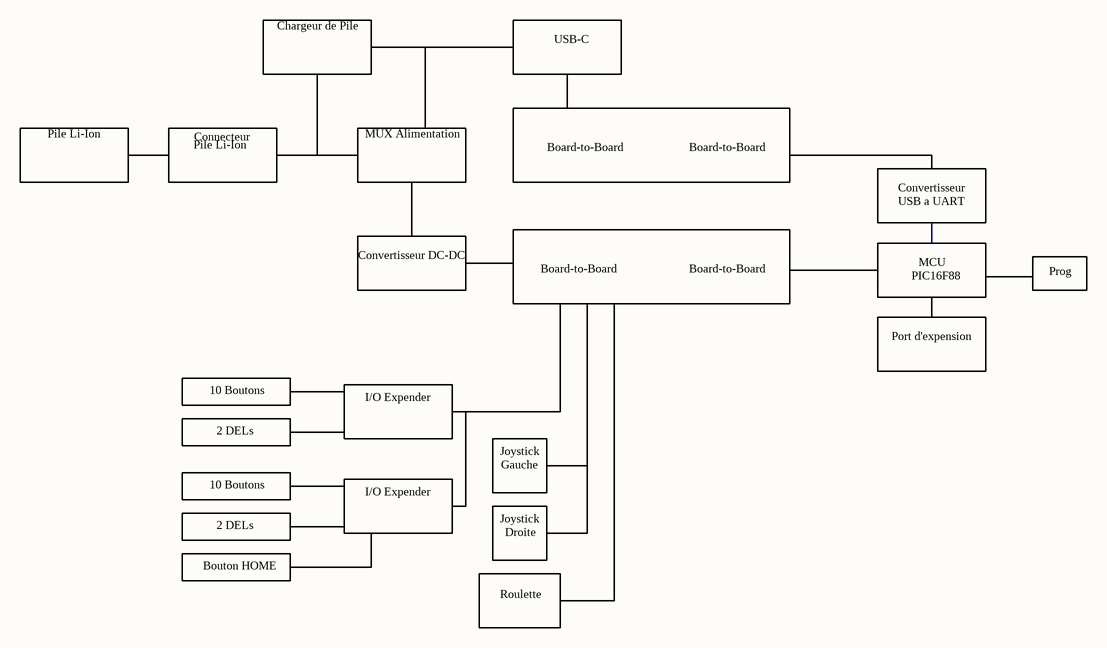
[diagram p6: SchemaBloc.SchDoc]

### Notes on the sheet
- Chargeur de Pile
- USB-C
- Pile Li-Ion
- Connecteur
- MUX Alimentation
- Board-to-Board
- Convertisseur
- USB a UART
- Convertisseur DC-DC
- MCU
- Prog
- Port d'expension
- PIC16F88
- 10 Boutons
- I/O Expender
- 2 DELs
- Joystick
- Gauche
- Droite
- Bouton HOME
- Roulette
- Titre :
- Conception :
- Date :
- Approbation :
- Heure :
- Révision :
- Feuille
- de
- Fichier :

## Nets that join several sheets
GND: PageTete (R15.1), Alimentation (30 pins), U_ButtonStick LEFT (15 pins), ControleurInterface (6 pins), HomeLedEncoder (6 pins), U_IOExpander LEFT (C1A.1 C2A.1 C12A.1 U3A.9), U_ButtonStick RIGHT (15 pins), U_IOExpander RIGHT (C1B.1 C2B.1 C12B.1 U3B.9)
VBUS: Alimentation (9 pins), ControleurInterface (R13.2)
VCC: PageTete (R12.2), Alimentation (C6.1 C9.2 R7.2 U6.1), U_ButtonStick LEFT (U8A.3 U8A.6), ControleurInterface (P1.2 P2.10), U_IOExpander LEFT (6 pins), U_ButtonStick RIGHT (U8B.3 U8B.6), U_IOExpander RIGHT (6 pins)
ADC1: U_ButtonStick LEFT (C8A.2 U8A.2), ControleurInterface (P2.9)
ADC2: U_ButtonStick LEFT (C7A.2 U8A.5), ControleurInterface (P2.7)
ADC3: ControleurInterface (P2.5), U_ButtonStick RIGHT (C7B.2 U8B.5)
ADC4: ControleurInterface (P2.3), U_ButtonStick RIGHT (C8B.2 U8B.2)
B1L: U_ButtonStick LEFT (S8A.1), U_IOExpander LEFT (U3A.8)
B1R: U_ButtonStick RIGHT (S8B.1), U_IOExpander RIGHT (U3B.8)
B2L: U_ButtonStick LEFT (S9A.1), U_IOExpander LEFT (U3A.10)
B2R: U_ButtonStick RIGHT (S9B.1), U_IOExpander RIGHT (U3B.10)
But1L: U_ButtonStick LEFT (U8A.8 U8A.10), U_IOExpander LEFT (U3A.11)
But1R: U_ButtonStick RIGHT (U8B.8 U8B.10), U_IOExpander RIGHT (U3B.11)
DownL: U_ButtonStick LEFT (S7A.1), U_IOExpander LEFT (U3A.7)
DownR: U_ButtonStick RIGHT (S7B.1), U_IOExpander RIGHT (U3B.7)
ENCODERA: ControleurInterface (P2.4), HomeLedEncoder (U2.1)
ENCODERB: ControleurInterface (P2.2), HomeLedEncoder (U2.2)
I2CCLOCK: ControleurInterface (P2.8), U_IOExpander LEFT (U3A.19), U_IOExpander RIGHT (U3B.19)
I2CDATA: ControleurInterface (P2.6), U_IOExpander LEFT (U3A.20), U_IOExpander RIGHT (U3B.20)
INT1: ControleurInterface (P1.6), U_IOExpander LEFT (U3A.22)
INT2: ControleurInterface (P1.8), U_IOExpander RIGHT (U3B.22)
LeftL: U_ButtonStick LEFT (S5A.1), U_IOExpander LEFT (U3A.5)
LeftR: U_ButtonStick RIGHT (S5B.1), U_IOExpander RIGHT (U3B.5)
NetDS1_2: HomeLedEncoder (DS1.2), U_IOExpander LEFT (U3A.12)
NetDS2_2: HomeLedEncoder (DS2.2), U_IOExpander RIGHT (U3B.13)
NetDS3_2: HomeLedEncoder (DS3.2), U_IOExpander LEFT (U3A.13)
NetDS4_2: HomeLedEncoder (DS4.2), U_IOExpander RIGHT (U3B.12)
NetR12_1: PageTete (R12.1), U_IOExpander RIGHT (U3B.18)
NetR15_2: PageTete (R15.2), U_IOExpander LEFT (U3A.18)
NetS10_1: HomeLedEncoder (S10.1), U_IOExpander RIGHT (U3B.17)
RightL: U_ButtonStick LEFT (S6A.1), U_IOExpander LEFT (U3A.6)
RightR: U_ButtonStick RIGHT (S6B.1), U_IOExpander RIGHT (U3B.6)
Select1L: U_ButtonStick LEFT (S3A.1), U_IOExpander LEFT (U3A.1)
Select1R: U_ButtonStick RIGHT (S3B.1), U_IOExpander RIGHT (U3B.1)
Select2L: U_ButtonStick LEFT (S2A.1), U_IOExpander LEFT (U3A.2)
Select2R: U_ButtonStick RIGHT (S2B.1), U_IOExpander RIGHT (U3B.2)
TopL: U_ButtonStick LEFT (S1A.1), U_IOExpander LEFT (U3A.3)
TopR: U_ButtonStick RIGHT (S1B.1), U_IOExpander RIGHT (U3B.3)
UpL: U_ButtonStick LEFT (S4A.1), U_IOExpander LEFT (U3A.4)
UpR: U_ButtonStick RIGHT (S4B.1), U_IOExpander RIGHT (U3B.4)
USB_N: Alimentation (U1.A7 U1.B7 U4.2 U4.9), ControleurInterface (P1.3)
USB_P: Alimentation (U1.A6 U1.B6 U4.1 U4.10), ControleurInterface (P1.5)